# EAGLE design LED_PCB_Rev2 (EAGLE 9.6.1)
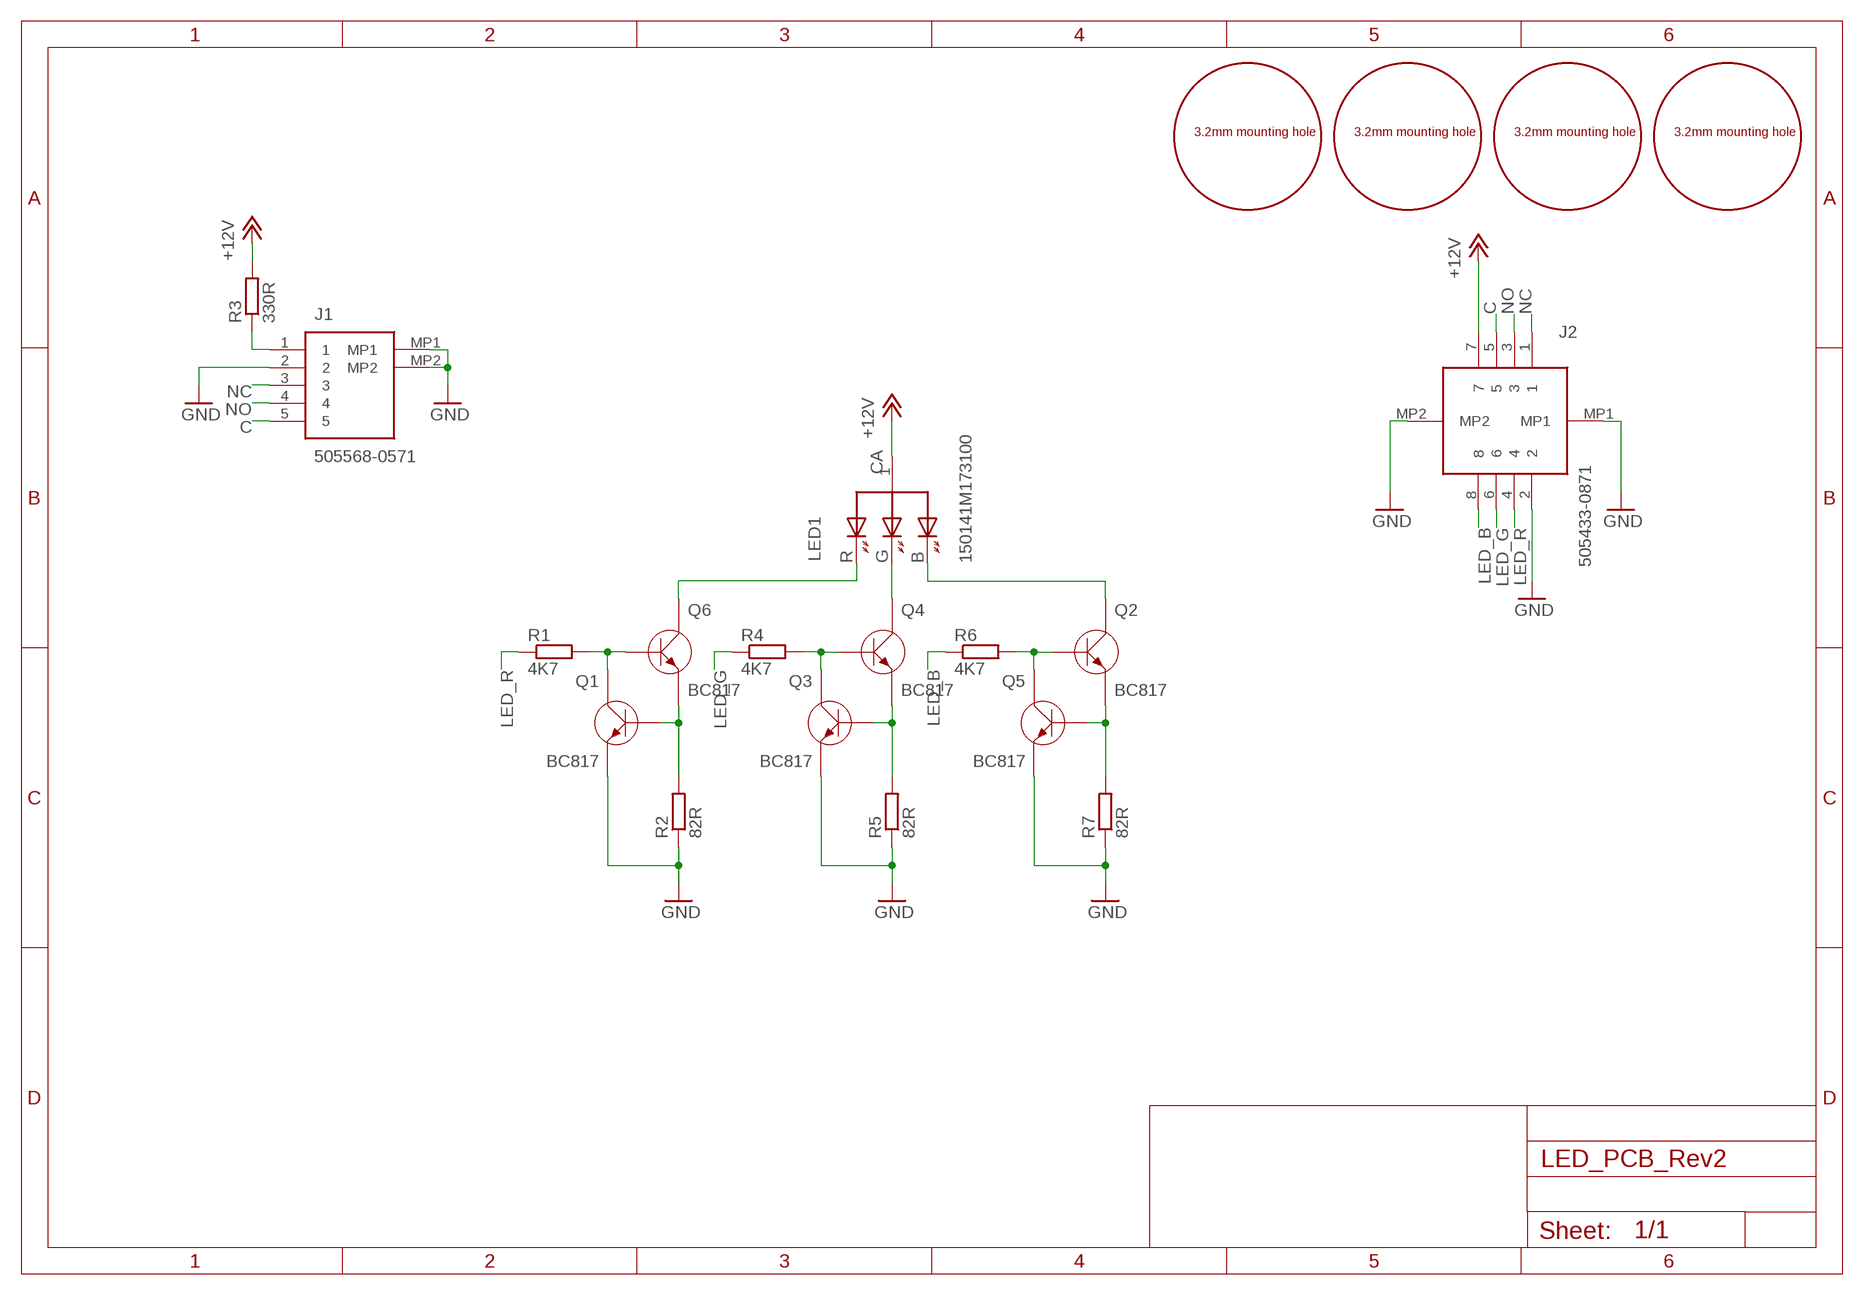
[diagram p0: schematic, sheet 1]

## Parts
J1  505568-0571  [5055680571]
J2  505433-0871  [5054330871]
LED1  150141M173100  [150141M173100]
Q1  BC817  [SOT23]
Q2  BC817  [SOT23]
Q3  BC817  [SOT23]
Q4  BC817  [SOT23]
Q5  BC817  [SOT23]
Q6  BC817  [SOT23]
R1  4K7  R0603  [R0603]
R2  82R  R0603  [R0603]
R3  330R  R0603  [R0603]
R4  4K7  R0603  [R0603]
R5  82R  R0603  [R0603]
R6  4K7  R0603  [R0603]
R7  82R  R0603  [R0603]
U$1  M3_MOUNTING_HOLE  [M3_MOUNTING_HOLE]
U$2  M3_MOUNTING_HOLE  [M3_MOUNTING_HOLE]
U$3  M3_MOUNTING_HOLE  [M3_MOUNTING_HOLE]
U$4  M3_MOUNTING_HOLE  [M3_MOUNTING_HOLE]

## Nets
+12V: J2.7 LED1.1(CA) R3.2
C: J1.5 J2.5
GND: J1.2 J1.MP1 J1.MP2 J2.2 J2.MP1 J2.MP2 Q1.2(E) Q3.2(E) Q5.2(E) R2.1 R5.1 R7.1
LED_B: J2.8 R6.1
LED_G: J2.6 R4.1
LED_R: J2.4 R1.1
N$1: Q1.1(B) Q6.2(E) R2.2
N$2: Q1.3(C) Q6.1(B) R1.2
N$3: LED1.4(G) Q4.3(C)
N$4: Q3.1(B) Q4.2(E) R5.2
N$5: Q3.3(C) Q4.1(B) R4.2
N$6: LED1.3(R) Q6.3(C)
N$7: Q2.2(E) Q5.1(B) R7.2
N$8: Q2.1(B) Q5.3(C) R6.2
N$9: LED1.2(B) Q2.3(C)
N$10: J1.1 R3.1
NC: J1.3 J2.1
NO: J1.4 J2.3

## Library data of the parts
J1 = RescueRunner:505568-0571: Headers & Wire Housings MicroLockPlus 1.25MM VERT HDR SR 5CKT BLK Source: Datasheet <http://uk.rs-online.com/web/p/products/1615926P>; ALLIED_NUMBER: 71085525; DESCRIPTION: Headers & Wire Housings MicroLockPlus 1.25MM VERT HDR SR 5CKT BLK; HEIGHT: 4.05mm; MANUFACTURER_NAME: Molex; MANUFACTURER_PART_NUMBER: 505568-0571; RS_PART_NUMBER: 1615926P; RS_PRICE-STOCK: http://uk.rs-online.com/web/p/products/1615926P
J2 = RescueRunner:505433-0871: CONN HEADER SMD 8POS 1.25MM Source: Datasheet <https://www.molex.com/pdm_docs/sd/5054330871_sd.pdf>; DESCRIPTION: CONN HEADER SMD 8POS 1.25MM; HEIGHT: 7.25mm; MANUFACTURER_NAME: Molex; MANUFACTURER_PART_NUMBER: 5054330871
LED1 = CASE-LED:150141M173100: Wurth Elektronik 150141M173100 Common Anode RGB LED Description: 150141M173100 Common Anode RGB LED from Wurth Elektronik. Links: Datasheet <https://www.mouser.se/datasheet/2/445/150141M173100-1714646.pdf>
Q1-Q6 = CASE-Transistors:BC817: BC817 NPN Transistor (SOT-23) Description: Standard BC817 NPN Transistor in a SOT-23 package Links: BC817,215 <http://www.farnell.com/datasheets/699988.pdf?_ga=2.36626660.510093211.1546607516-411290609.1543318711>
R1-R7 = CASE-RCL:R0603: Standard Chip RESISTOR 0603 (1608 Metric) Description: Standard Chip RESISTOR 0603 (1608 Metric)
U$1-U$4 = RescueRunner:M3_MOUNTING_HOLE

## Net classes
0 default: width 0.2 mm

## Board
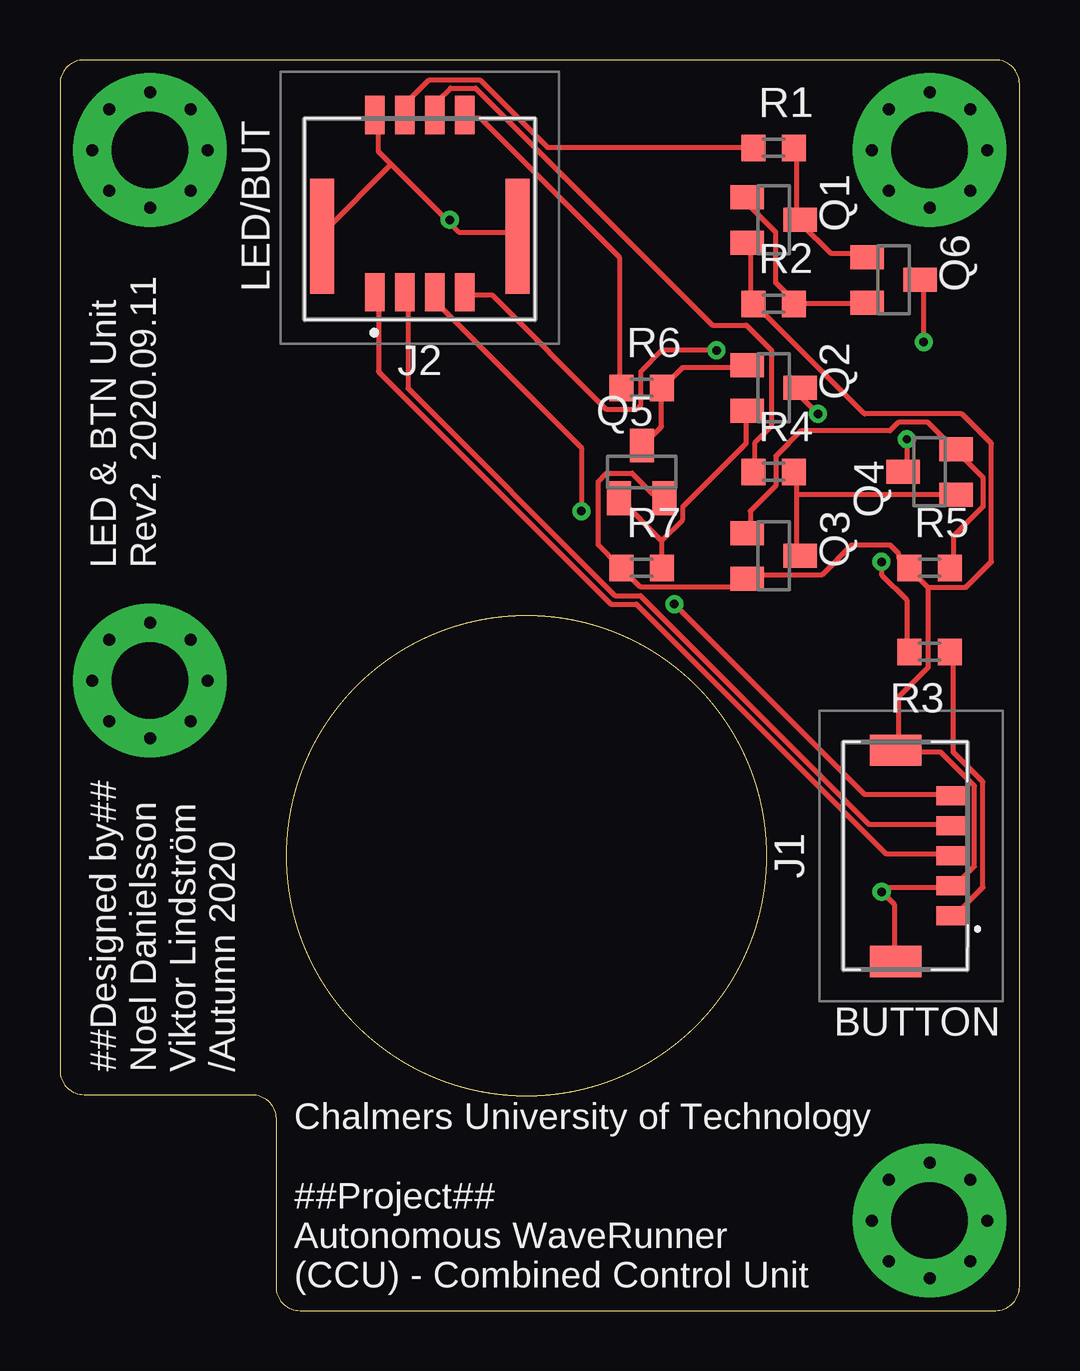
[diagram p1: board, top side]
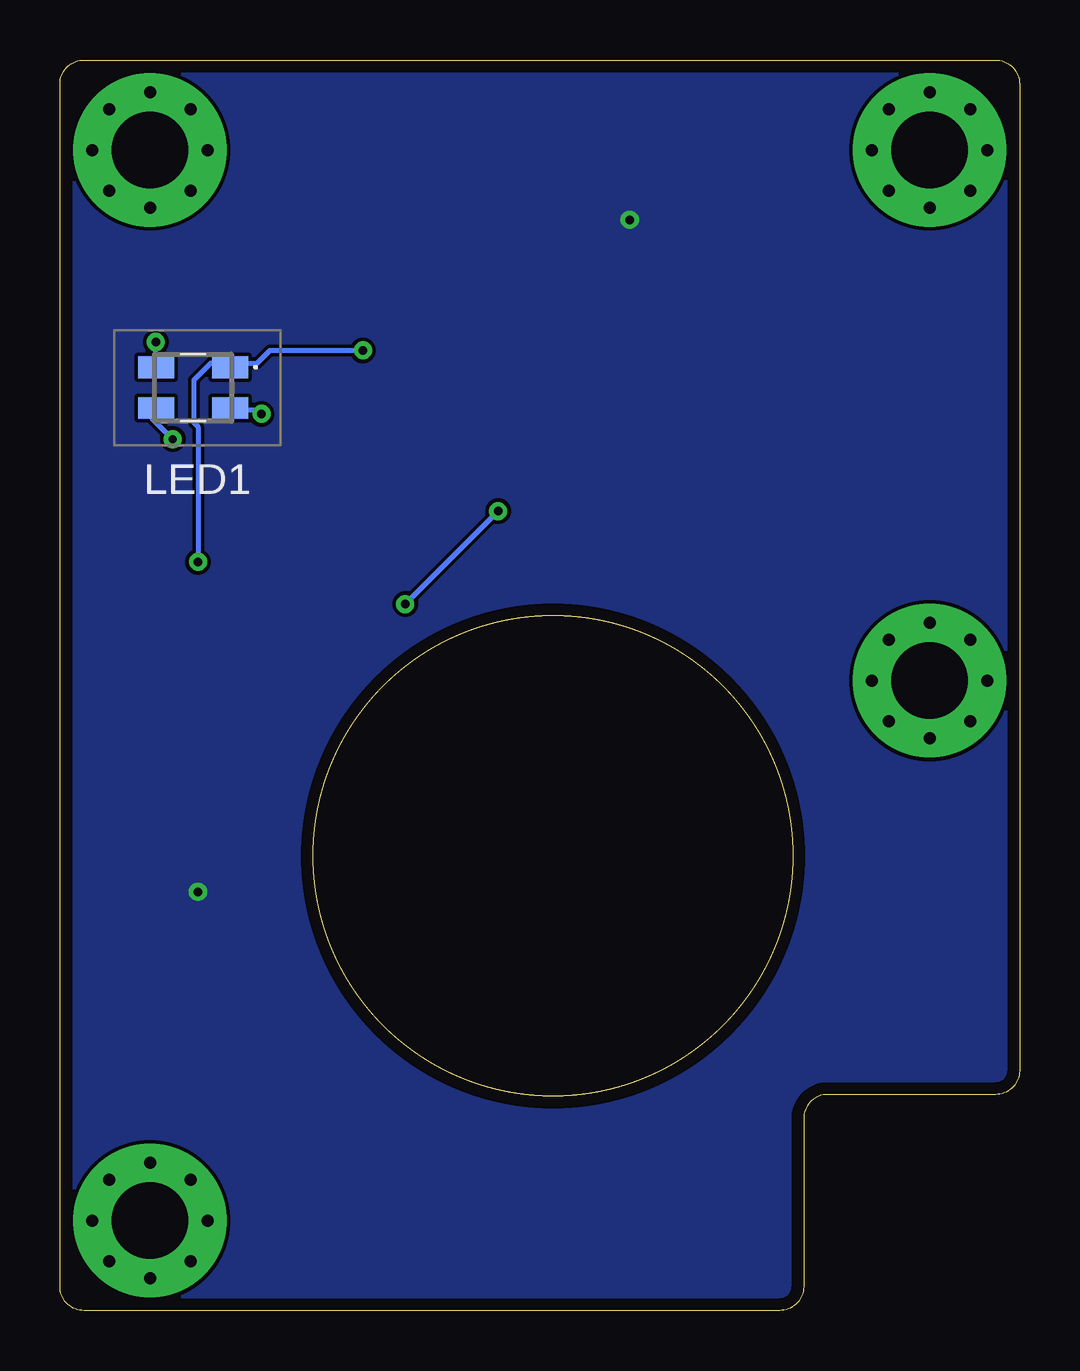
[diagram p2: board, bottom side, seen from below]

Size 40 x 52.11 mm. Coordinates in mm from the lower left corner, seen from the top.
Outline: 39,52.11 1,52.11 arc90 0,51.11 0,10 arc90 1,9 8,9 arc-90 9,8 9,1 arc90 10,0 39,0 arc90 40,1 40,51.11 arc90 39,52.11
Outline: circle at 19.45,18.95 radius 10
Copper layers (1*16): Top 0.035mm / dielectric 1.5mm / Bottom 0.035mm
Design rules "default *": minimum track width 6mil, minimum drill 0.35mm, track to track 6mil, track to pad 6mil, pad to pad 6mil, via to via 6mil, smd to smd 6mil, copper to edge 20mil, drill to drill 6mil, minimum pad ring 10mil, minimum via ring 8mil, stop-mask expansion 4mil, vias tented up to drill 0mil, thermal gap 10mil

### Footprints (pad centres in the part's own frame; a part is rotated, then mirrored left to right if it is on the bottom)
5055680571 = smd 0.8 x 1.2: 1 -2.5,-1.882; 2 -1.25,-1.882; 3 0,-1.882; 4 1.25,-1.882; 5 2.5,-1.882 | smd 1.3 x 2.15: MP1 -4.4,0.412; MP2 4.4,0.412
5054330871 = smd 0.8 x 1.6: 1 1.875,3.517; 2 1.875,-3.873; 3 0.625,3.517; 4 0.625,-3.873; 5 -0.625,3.517; 6 -0.625,-3.873; 7 -1.875,3.517; 8 -1.875,-3.873 | smd 1 x 4.8: MP1 4.075,1.177; MP2 -4.075,1.177
150141M173100 = smd 1.5 x 0.9: 1 1.55,0.85; 2 1.55,-0.85; 3 -1.55,0.85; 4 -1.55,-0.85
SOT23 = smd 1 x 1.4: 1 -0.95,-1.1; 2 0.95,-1.1; 3 0,1.1
R0603 = smd 1 x 1.1: 1 -0.85,0; 2 0.85,0
M3_MOUNTING_HOLE = drill 0.5 pad 0.8: P$1 -2.4,0; P$2 0,2.4; P$3 2.4,0; P$4 0,-2.4; P$5 -1.697,1.697; P$6 1.697,1.697; P$7 1.697,-1.697; P$8 -1.697,-1.697 | drill 3.2 pad 6.4: P$10 0,0

### Placement (x,y rotation side)
J1  35.25,18.95 90 top
J2  15,45.95 180 top
LED1  34.45,38.45 0 bottom
Q1  29.75,45.45 270 top
Q2  29.75,38.45 270 top
Q3  29.75,31.45 270 top
Q4  36.25,34.95 90 top
Q5  24.25,34.95 0 top
Q6  34.75,42.95 270 top
R1  29.75,48.45 0 top
R2  29.75,41.95 0 top
R3  36.25,27.45 180 top
R4  29.75,34.95 0 top
R5  36.25,30.95 0 top
R6  24.25,38.45 0 top
R7  24.25,30.95 0 top
U$1  3.75,48.36 0 top
U$2  3.75,26.25 0 top
U$3  36.25,3.75 0 top
U$4  36.25,48.36 0 top

### Tracks (layer width: path | path; a pad name or v marks a point on that pad's centre or on a via)
+12V  (via drill 0.35)
  Top 0.2: v34.24,31.2 34.24,30.67 35.3,29.61 35.3,27.5 R3.2 | v27.37,40.01 25.08,40.01 24.2,39.13 24.2,37.72 24.02,37.54 22.79,37.54 18.03,42.3 16.98,42.3 J2.7
  Bottom 0.2: v34.24,31.2 34.24,36.83 34.42,37.01 34.42,38.77 33.72,39.48 33.01,39.48 LED1.1 32.83,39.48 31.78,39.48 31.25,40.01 v27.37,40.01
C  (via drill 0.35)
  Top 0.2: v25.61,29.43 33.54,21.51 37.06,21.51 J1.5 | v21.73,33.31 21.73,35.95 15.74,41.94 15.74,42.3 J2.5
  Bottom 0.2: v21.73,33.31 v25.61,29.43
GND  (via drill 0.35)
  Top 0.2: Q1.2 28.78,44.41 28.78,42.12 R2.1 28.96,41.94 33.54,37.36 37.59,37.36 38.83,36.13 38.83,31.2 37.77,30.14 36.18,30.14 | Q5.2 25.08,34.02 24.73,34.02 23.85,34.9 22.79,34.9 22.44,34.54 22.44,31.9 23.32,31.02 R7.1 23.49,30.84 24.2,30.14 28.25,30.14 28.6,30.49 Q3.2 28.78,30.67 31.78,30.67 33.01,31.9 34.6,31.9 34.95,31.55 34.95,31.37 35.3,31.02 R5.1 35.48,30.84 36.18,30.14 | 36.18,30.14 36.18,26.79 34.95,25.56 34.95,23.44 J1.MP2 34.95,23.27 36.71,23.27 38.12,21.86 38.12,18.51 37.24,17.63 J1.2 37.06,17.63 34.6,17.63 34.42,17.45 v34.25,17.45 34.42,17.28 34.77,16.92 34.77,14.63 J1.MP1 | 13.8,47.76 16.09,45.47 v16.25,45.45 16.27,45.29 16.62,44.94 18.91,44.94 J2.MP2 | 13.8,47.76 13.28,48.29 13.28,49.7 J2.2 | 13.8,47.76 10.98,44.94 J2.MP1
  pour Bottom: -0.25,52.45 40.25,52.45 40.25,-0.05 -0.25,-0.05
LED_B
  Top 0.2: R6.1 23.32,38.6 23.32,43.88 17.5,49.7 16.98,49.7 J2.8
LED_G
  Top 0.2: R4.1 28.96,35.07 28.96,36.13 29.66,36.83 29.66,40.01 28.6,41.06 27.2,41.06 17.33,50.93 16.27,50.93 15.74,50.4 15.74,49.87 J2.6
LED_R
  Top 0.2: R1.1 28.78,48.46 20.32,48.46 17.5,51.28 15.39,51.28 14.51,50.4 14.51,49.87 J2.4
N$1
  Top 0.2: Q6.2 33.54,41.94 30.72,41.94 R2.2 30.54,42.12 29.84,42.83 29.84,44.94 28.78,46 28.78,46.35 Q1.1
N$2
  Top 0.2: R1.2 30.72,48.29 30.72,45.47 Q1.3 30.9,45.29 32.13,44.06 33.54,44.06 Q6.1
N$3  (via drill 0.35)
  Top 0.2: v35.3,36.31 35.3,35.07 Q4.3
  Bottom 0.2: v35.3,36.31 36.18,37.19 36.18,37.36 36.01,37.54 LED1.4
N$4
  Top 0.2: R5.2 37.24,31.02 37.24,32.25 38.47,33.49 38.47,34.72 37.41,35.78 Q4.2 37.24,35.95 36.18,37.01 34.95,37.01 34.6,36.66 30.9,36.66 29.84,35.6 29.84,34.37 28.78,33.31 28.78,32.43 Q3.1
N$5
  Top 0.2: 30.72,34.02 30.72,31.55 Q3.3 | 30.72,34.02 30.72,34.9 R4.2 | 30.72,34.02 37.24,34.02 Q4.1
N$6  (via drill 0.35)
  Top 0.2: v36.01,40.36 36.01,42.83 Q6.3
  Bottom 0.2: v36.01,40.36 36.01,39.48 LED1.3
N$7
  Top 0.2: 25.08,32.08 25.08,31.02 R7.2 | 25.08,32.08 23.32,33.84 Q5.1 | 25.08,32.08 25.96,32.96 25.96,33.49 28.6,36.13 28.6,37.36 Q2.2
N$8
  Top 0.2: Q5.3 24.38,36.13 25.08,36.83 25.08,38.42 R6.2 25.26,38.6 25.96,39.3 28.6,39.3 Q2.1
N$9  (via drill 0.35)
  Top 0.2: v31.6,37.36 30.9,38.07 30.9,38.42 Q2.3
  Bottom 0.2: v31.6,37.36 31.78,37.54 32.83,37.54 LED1.2
N$10
  Top 0.2: R3.1 37.24,27.32 37.24,23.27 38.47,22.03 38.47,17.63 37.24,16.4 J1.1
NC
  Top 0.2: J1.3 37.06,19.04 34.42,19.04 24.02,29.43 22.97,29.43 13.28,39.13 13.28,42.3 J2.1
NO
  Top 0.2: J1.4 37.06,20.27 33.72,20.27 24.2,29.79 23.14,29.79 14.51,38.42 14.51,42.3 J2.3

### Text on the board
tPlace: LED/BUT | LED & BTN Unit / Rev2, 2020.09.11 | BUTTON | ##Designed by## / Noel Danielsson / Viktor Lindström / /Autumn 2020 | Chalmers University of Technology / / ##Project## / Autonomous WaveRunner / (CCU) - Combined Control Unit